# EAGLE design CBM Drive ID Switch Parallel Rev 1 (EAGLE 9.7.0)
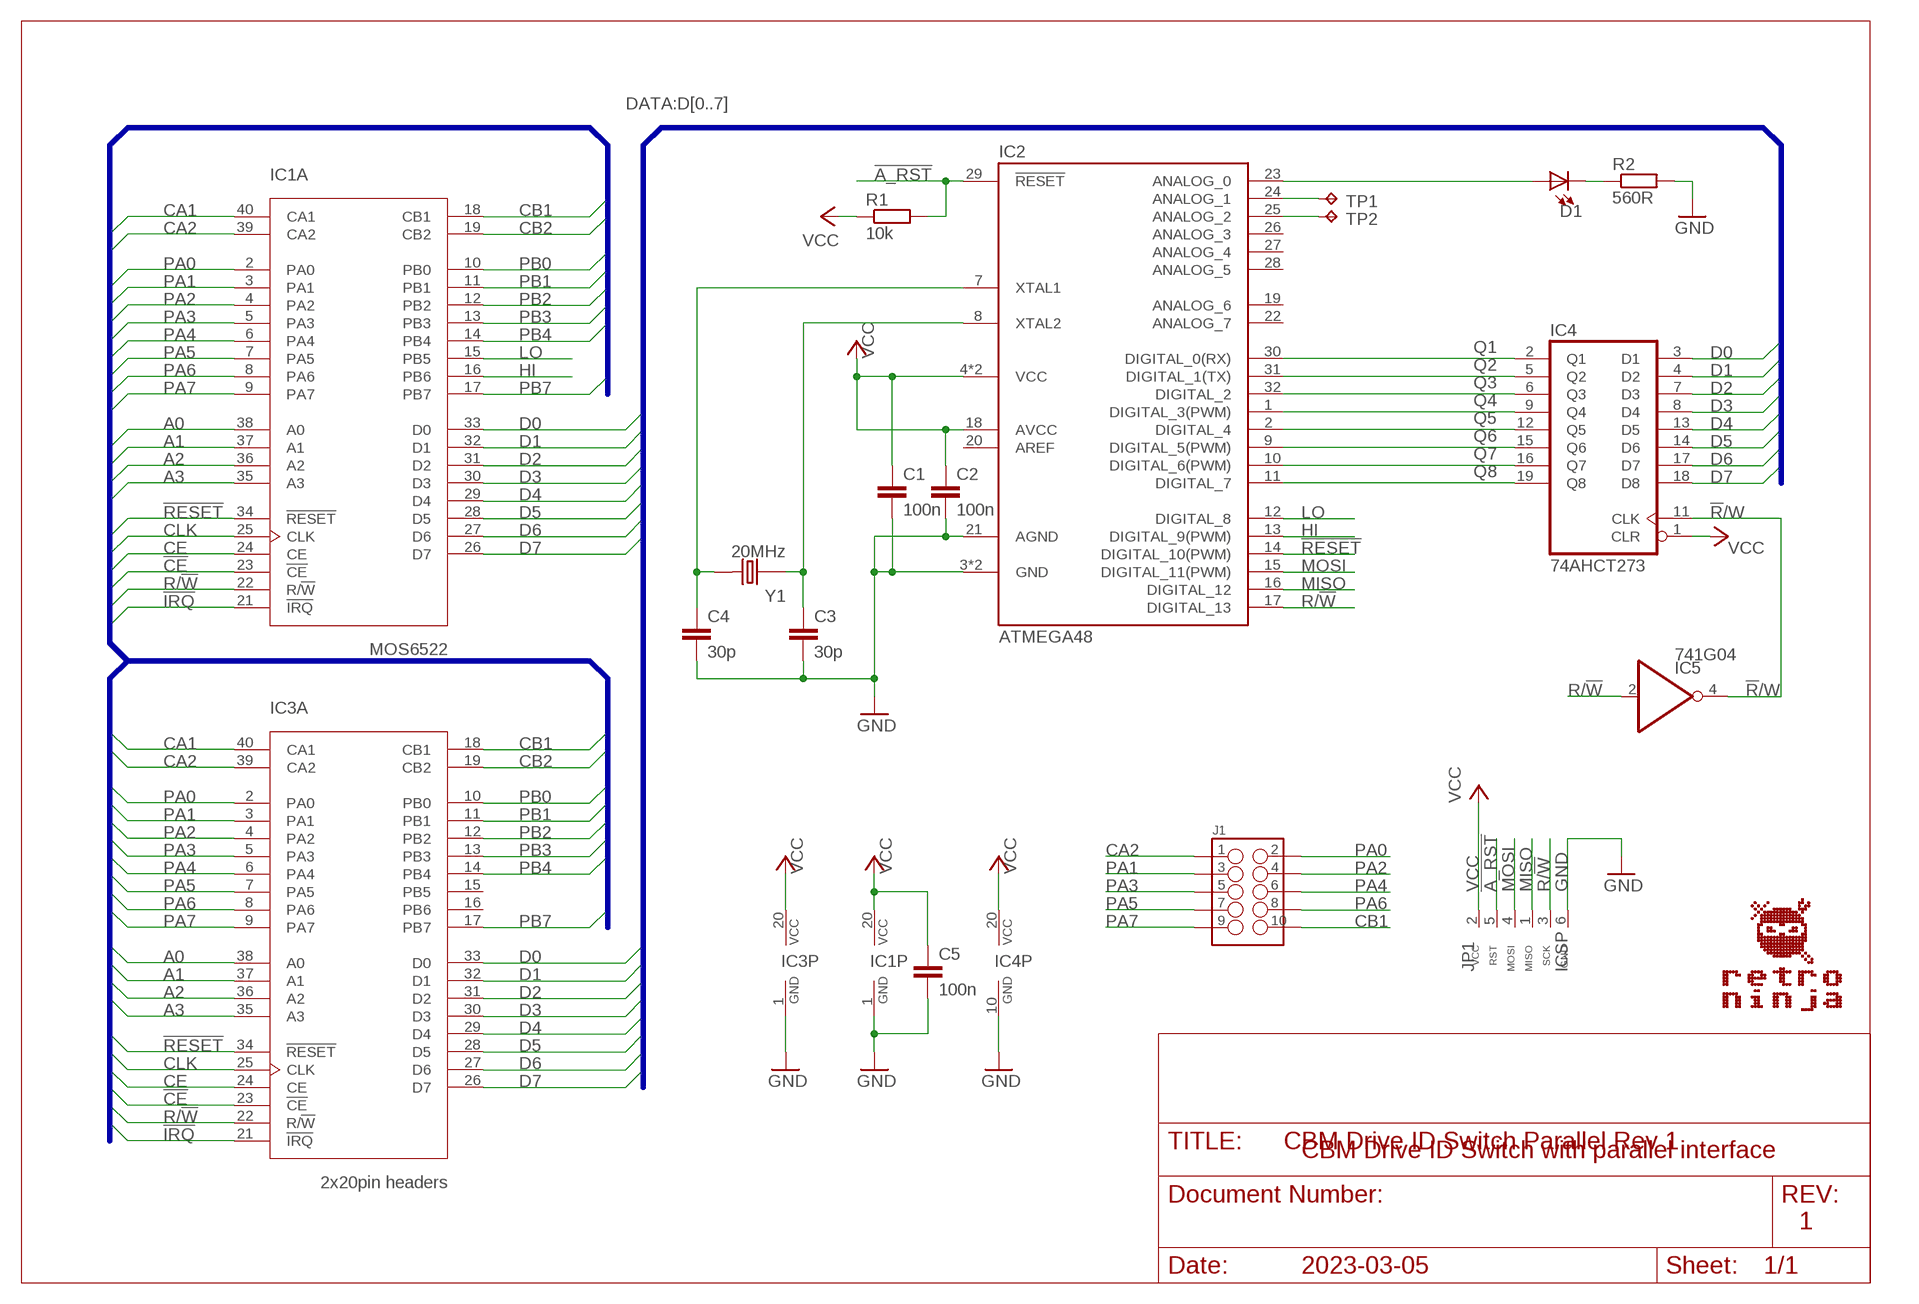
[diagram p0: schematic, sheet 1]

## Parts
C1  100n  C-EUC0805  [C0805]
C2  100n  C-EUC0805  [C0805]
C3  30p  C-EUC0805  [C0805]
C4  30p  C-EUC0805  [C0805]
C5  100n  C-EUC0805  [C0805]
D1  LED_0805  [LED0805]
IC1  MOS6522  MOS6522_HEADERS-F  [DIL40-6_HEADERS-F]
IC2  ATMEGA48  ARDUINO_168_328_TQFP  [TQFP-32]
IC3  2x20pin headers  MOS6522_ROUND_BOTTOMPINS  [DIL40-6_ROUND_BOTTOMPINS]
IC4  74AHCT273  74273N_NARROW  [SO20_NARROW]
IC5  741G04  741G04_SOT23  [SOT23-5]
J1  HEADER_2X5-WALLED-90  [HEADER_2X5_WALLED_RIGHT]
JP1  ICSP  ICSP_CONNECTOR_6_ALT  [HEADER_2X3_ALT]
R1  10k  R-EU_R0805  [R0805]
R2  560R  R-EU_R0805  [R0805]
TP1  TPTP20SQ  [TP20SQ]
TP2  TPTP20SQ  [TP20SQ]
Y1  20MHz  CRYSTAL  [CRYSTAL_SMD-2_7X4X2.3]

## Nets
!A_RST: IC2.29(!RESET) JP1.5(RST) R1.2
!CE: IC1.23(A:!CE) IC3.23(A:!CE)
!IRQ: IC1.21(A:!IRQ) IC3.21(A:!IRQ)
!R!/W: IC4.11(CLK) IC5.4(O)
!RESET: IC1.34(A:!RESET) IC2.14(DIGITAL_10(PWM)) IC3.34(A:!RESET)
A0: IC1.38(A:A0) IC3.38(A:A0)
A1: IC1.37(A:A1) IC3.37(A:A1)
A2: IC1.36(A:A2) IC3.36(A:A2)
A3: IC1.35(A:A3) IC3.35(A:A3)
CA1: IC1.40(A:CA1) IC3.40(A:CA1)
CA2: IC1.39(A:CA2) IC3.39(A:CA2) J1.1
CB1: IC1.18(A:CB1) IC3.18(A:CB1) J1.10
CB2: IC1.19(A:CB2) IC3.19(A:CB2)
CE: IC1.24(A:CE) IC3.24(A:CE)
CLK: IC1.25(A:CLK) IC3.25(A:CLK)
D0: IC1.33(A:D0) IC3.33(A:D0) IC4.3(D1)
D1: IC1.32(A:D1) IC3.32(A:D1) IC4.4(D2)
D2: IC1.31(A:D2) IC3.31(A:D2) IC4.7(D3)
D3: IC1.30(A:D3) IC3.30(A:D3) IC4.8(D4)
D4: IC1.29(A:D4) IC3.29(A:D4) IC4.13(D5)
D5: IC1.28(A:D5) IC3.28(A:D5) IC4.14(D6)
D6: IC1.27(A:D6) IC3.27(A:D6) IC4.17(D7)
D7: IC1.26(A:D7) IC3.26(A:D7) IC4.18(D8)
GND: C1.2 C2.2 C3.2 C4.2 C5.2 IC1.1(P:GND) IC2.3(GND) IC2.5(GND) IC2.21(AGND) IC3.1(P:GND) IC4.10(GND) JP1.6(GND) R2.2
HI: IC1.16(A:PB6) IC2.13(DIGITAL_9(PWM))
LO: IC1.15(A:PB5) IC2.12(DIGITAL_8)
MISO: IC2.16(DIGITAL_12) JP1.1(MISO)
MOSI: IC2.15(DIGITAL_11(PWM)) JP1.4(MOSI)
N$1: IC2.24(ANALOG_1) TP1.TP
N$2: IC2.25(ANALOG_2) TP2.TP
N$16: C3.1 IC2.8(XTAL2) Y1.1
N$17: C4.1 IC2.7(XTAL1) Y1.2
N$25: D1.A IC2.23(ANALOG_0)
N$26: D1.C R2.1
PA0: IC1.2(A:PA0) IC3.2(A:PA0) J1.2
PA1: IC1.3(A:PA1) IC3.3(A:PA1) J1.3
PA2: IC1.4(A:PA2) IC3.4(A:PA2) J1.4
PA3: IC1.5(A:PA3) IC3.5(A:PA3) J1.5
PA4: IC1.6(A:PA4) IC3.6(A:PA4) J1.6
PA5: IC1.7(A:PA5) IC3.7(A:PA5) J1.7
PA6: IC1.8(A:PA6) IC3.8(A:PA6) J1.8
PA7: IC1.9(A:PA7) IC3.9(A:PA7) J1.9
PB0: IC1.10(A:PB0) IC3.10(A:PB0)
PB1: IC1.11(A:PB1) IC3.11(A:PB1)
PB2: IC1.12(A:PB2) IC3.12(A:PB2)
PB3: IC1.13(A:PB3) IC3.13(A:PB3)
PB4: IC1.14(A:PB4) IC3.14(A:PB4)
PB7: IC1.17(A:PB7) IC3.17(A:PB7)
Q1: IC2.30(DIGITAL_0(RX)) IC4.2(Q1)
Q2: IC2.31(DIGITAL_1(TX)) IC4.5(Q2)
Q3: IC2.32(DIGITAL_2) IC4.6(Q3)
Q4: IC2.1(DIGITAL_3(PWM)) IC4.9(Q4)
Q5: IC2.2(DIGITAL_4) IC4.12(Q5)
Q6: IC2.9(DIGITAL_5(PWM)) IC4.15(Q6)
Q7: IC2.10(DIGITAL_6(PWM)) IC4.16(Q7)
Q8: IC2.11(DIGITAL_7) IC4.19(Q8)
R/!W: IC1.22(A:R/!W) IC2.17(DIGITAL_13) IC3.22(A:R/!W) IC5.2(I) JP1.3(SCK)
VCC: C1.1 C2.1 C5.1 IC1.20(P:VCC) IC2.4(VCC) IC2.6(VCC) IC2.18(AVCC) IC3.20(P:VCC) IC4.1(CLR) IC4.20(VCC) JP1.2(VCC) R1.1
Unconnected: IC2.19(ANALOG_6) IC2.20(AREF) IC2.22(ANALOG_7) IC2.26(ANALOG_3) IC2.27(ANALOG_4) IC2.28(ANALOG_5) IC3.15(A:PB5) IC3.16(A:PB6)

## Buses
DATA:D[0..7]
A[0..3],CA[0..1],CB[0..1],CE,!CE,CLK,!IRQ,PA[0..7],PB[0..7],!RESET,R/!W

## Notes on the sheet
- CBM Drive ID Switch with parallel interface
- 1
- 2023-03-05

## Power pins joined to a net without a drawn wire
GND: IC5.3(GND)
VCC: IC5.5(VCC)

## Library data of the parts
C1-C5 = rcl:C-EU: CAPACITOR, European symbol; SPICEPREFIX: C
D1 = Per (Fusion 360):LED
IC1 IC3 = Per (Fusion 360):MOS6522
IC2 = Per (Fusion 360):ARDUINO_168_328
IC4 = Per (Fusion 360):74*273
IC5 = Per (Fusion 360):74*1G04
J1 = Per (Fusion 360):HEADER_2X5
JP1 = Per (Fusion 360):ICSP_CONNECTOR: PIN HEADER
R1 R2 = rcl:R-EU_: RESISTOR, European symbol; SPICEPREFIX: R
TP1 TP2 = testpad:TP: Test pad
Y1 = Per (Fusion 360):CRYSTAL

## Board
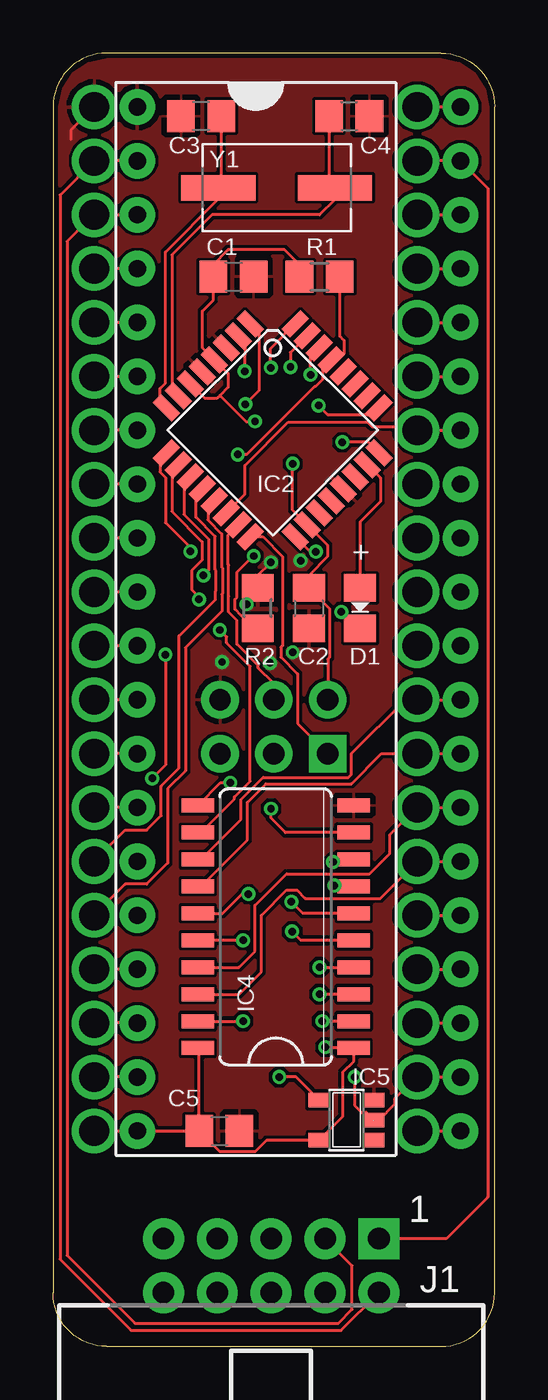
[diagram p1: board, top side]
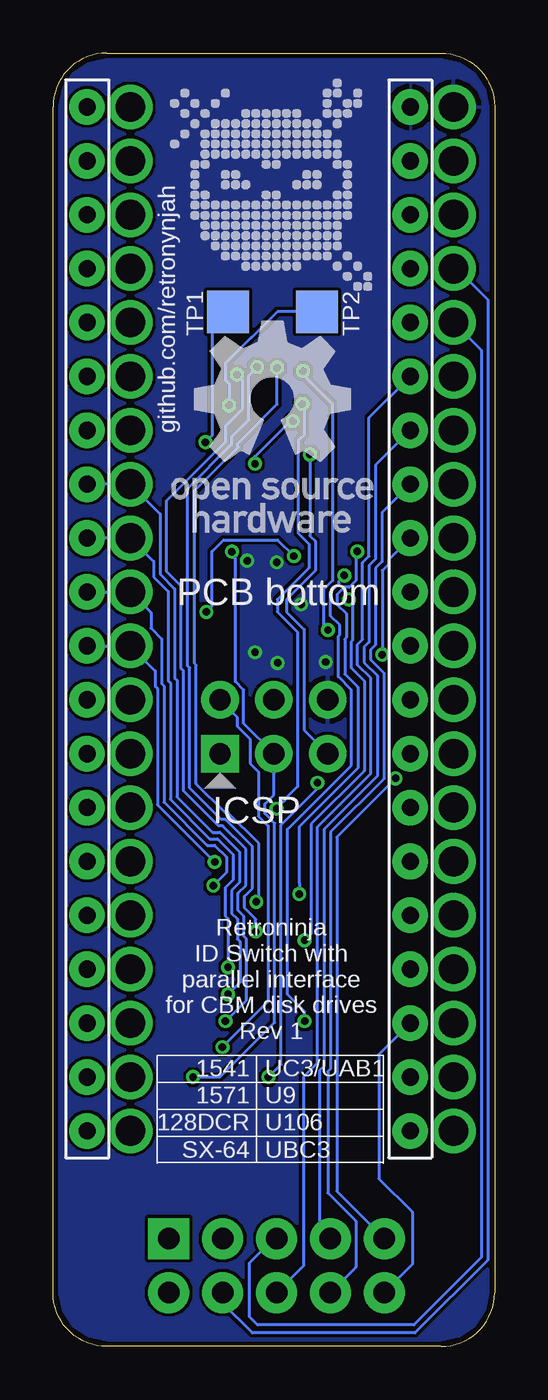
[diagram p2: board, bottom side, seen from below]

Size 20.83 x 60.96 mm. Coordinates in mm from the lower left corner, seen from the top.
Outline: 2.54,0 18.29,0 arc90 20.83,2.54 20.83,58.42 arc90 18.29,60.96 2.54,60.96 arc90 0,58.42 0,2.54 arc90 2.54,0
Copper layers (1*16): Top / Bottom
Stack-up Default Layer Stack: Top User Defined 0.035mm / Dielectric-1 User Defined 1.5mm / Bottom User Defined 0.035mm
Design rules "SeeedStudio_2layer_DRU_no_angle_20140221": minimum track width 6mil, minimum drill 12mil, track to track 6mil, track to pad 6mil, pad to pad 6mil, via to via 6mil, smd to smd 0mil, copper to edge 10mil, drill to drill 10mil, minimum pad ring 10mil, minimum via ring 6mil, stop-mask expansion 2mil, vias tented up to drill 100mil, thermal gap 10mil

### Footprints (pad centres in the part's own frame; a part is rotated, then mirrored left to right if it is on the bottom)
C0805 = smd 1.3 x 1.5: 1 -0.95,0; 2 0.95,0
LED0805 = smd 1.3 x 1.5: A -0.95,0; C 0.95,0
DIL40-6_HEADERS-F = drill 1.4: 1 -24.13,-7.62; 2 -21.59,-7.62; 3 -19.05,-7.62; 4 -16.51,-7.62; 5 -13.97,-7.62; 6 -11.43,-7.62; 7 -8.89,-7.62; 8 -6.35,-7.62; 9 -3.81,-7.62; 10 -1.27,-7.62; 11 1.27,-7.62; 12 3.81,-7.62; 13 6.35,-7.62; 14 8.89,-7.62; 15 11.43,-7.62; 16 13.97,-7.62; 17 16.51,-7.62; 18 19.05,-7.62; 19 21.59,-7.62; 20 24.13,-7.62; 21 24.13,7.62; 22 21.59,7.62; 23 19.05,7.62; 24 16.51,7.62; 25 13.97,7.62; 26 11.43,7.62; 27 8.89,7.62; 28 6.35,7.62; 29 3.81,7.62; 30 1.27,7.62; 31 -1.27,7.62; 32 -3.81,7.62; 33 -6.35,7.62; 34 -8.89,7.62; 35 -11.43,7.62; 36 -13.97,7.62; 37 -16.51,7.62; 38 -19.05,7.62; 39 -21.59,7.62; 40 -24.13,7.62
TQFP-32 = smd 1.27 x 0.559: 1 -4.293,2.8; 2 -4.293,2; 3 -4.293,1.2; 4 -4.293,0.4; 5 -4.293,-0.4; 6 -4.293,-1.2; 7 -4.293,-2; 8 -4.293,-2.8; 17 4.293,-2.8; 18 4.293,-2; 19 4.293,-1.2; 20 4.293,-0.4; 21 4.293,0.4; 22 4.293,1.2; 23 4.293,2; 24 4.293,2.8 | smd 0.559 x 1.27: 9 -2.8,-4.293; 10 -2,-4.293; 11 -1.2,-4.293; 12 -0.4,-4.293; 13 0.4,-4.293; 14 1.2,-4.293; 15 2,-4.293; 16 2.8,-4.293; 25 2.8,4.293; 26 2,4.293; 27 1.2,4.293; 28 0.4,4.293; 29 -0.4,4.293; 30 -1.2,4.293; 31 -2,4.293; 32 -2.8,4.293
DIL40-6_ROUND_BOTTOMPINS = drill 0.813 pad 1.676: 1 -24.13,-7.62; 2 -21.59,-7.62; 3 -19.05,-7.62; 4 -16.51,-7.62; 5 -13.97,-7.62; 6 -11.43,-7.62; 7 -8.89,-7.62; 8 -6.35,-7.62; 9 -3.81,-7.62; 10 -1.27,-7.62; 11 1.27,-7.62; 12 3.81,-7.62; 13 6.35,-7.62; 14 8.89,-7.62; 15 11.43,-7.62; 16 13.97,-7.62; 17 16.51,-7.62; 18 19.05,-7.62; 19 21.59,-7.62; 20 24.13,-7.62; 21 24.13,7.62; 22 21.59,7.62; 23 19.05,7.62; 24 16.51,7.62; 25 13.97,7.62; 26 11.43,7.62; 27 8.89,7.62; 28 6.35,7.62; 29 3.81,7.62; 30 1.27,7.62; 31 -1.27,7.62; 32 -3.81,7.62; 33 -6.35,7.62; 34 -8.89,7.62; 35 -11.43,7.62; 36 -13.97,7.62; 37 -16.51,7.62; 38 -19.05,7.62; 39 -21.59,7.62; 40 -24.13,7.62
SO20_NARROW = smd 0.66 x 1.524: 1 -5.369,-3.765; 2 -4.099,-3.765; 3 -2.829,-3.765; 4 -1.559,-3.765; 5 -0.289,-3.765; 6 0.981,-3.765; 7 2.251,-3.765; 8 3.521,-3.765; 9 4.791,-3.765; 10 6.061,-3.765; 11 6.061,3.585; 12 4.791,3.585; 13 3.521,3.585; 14 2.251,3.585; 15 0.981,3.585; 16 -0.289,3.585; 17 -1.559,3.585; 18 -2.829,3.585; 19 -4.099,3.585; 20 -5.369,3.585
SOT23-5 = smd 0.69 x 0.99: 1 -0.95,-1.29; 2 0,-1.29; 3 0.95,-1.29; 4 0.95,1.3; 5 -0.95,1.3
HEADER_2X5_WALLED_RIGHT = drill 1.016 pad 1.93 square: 1 -5.08,-6.35 | drill 1.016 pad 1.93: 2 -5.08,-3.81; 3 -2.54,-6.35; 4 -2.54,-3.81; 5 0,-6.35; 6 0,-3.81; 7 2.54,-6.35; 8 2.54,-3.81; 9 5.08,-6.35; 10 5.08,-3.81
HEADER_2X3_ALT = drill 1 pad 1.778 square: 1 -2.54,-1.27 | drill 1 pad 1.778: 2 -2.54,1.27; 3 0,-1.27; 4 0,1.27; 5 2.54,-1.27; 6 2.54,1.27
R0805 = smd 1.3 x 1.5: 1 -0.95,0; 2 0.95,0
TP20SQ = smd 2 x 2: TP 0,0
CRYSTAL_SMD-2_7X4X2.3 = smd 3.5 x 1.2: 1 -2.75,0; 2 2.75,0

### Placement (x,y rotation side)
C1  8.51,50.42 0 top
C2  12.06,34.8 270 top
C3  6.99,57.99 180 top
C4  13.97,57.99 0 top
C5  7.84,10.16 0 top
D1  14.48,34.8 270 top
IC1  9.56,34.29 270 top
IC2  10.36,43.18 315 top
IC3  11.6,34.29 270 top
IC4  10.41,19.43 90 top
IC5  13.84,10.67 90 top
J1  10.29,-1.27 180 top
JP1  10.41,29.21 0 bottom
R1  12.57,50.42 0 top
R2  9.65,34.8 90 top
TP1  12.57,48.77 0 bottom
TP2  8.38,48.77 0 bottom
U$1  [RETRONINJA_NOTEXT_10MM]  10.54,54.99 0 bottom
U$2  [OSHW_10MM]  15.24,38.35 0 bottom
Y1  10.54,54.61 0 top

### Tracks (layer width: path | path; a pad name or v marks a point on that pad's centre or on a via)
!A_RST  (via drill 0.35)
  Top 0.152: R1.2 13.52,47.62 13.73,47.41 13.73,46.81 IC2.29 12.71,46.09 12.71,45.57 12.38,45.24 12.33,45.24 9.13,42.04 v8.71,42.04
  Bottom 0.152: JP1.5 8.99,29.06 8.99,33.8 9.81,34.62 9.81,35.21 8.46,36.56 8.46,37.95 8.71,38.2 v8.71,42.04
!CE
  Top 0.152: IC1.23 IC3.23
!IRQ
  Top 0.152: IC1.21 IC3.21
!R!/W  (via drill 0.35)
  Top 0.152: IC5.4 11.46,12.7 v10.67,12.7 | IC4.11 7.9,26.57 v8.36,26.57
  Bottom 0.152: v10.67,12.7 10.08,13.29 10.08,24.59 8.36,26.31 v8.36,26.57
!RESET
  Top 0.152: IC3.34 IC1.34 17,43.36 15.03,43.36 14.83,43.56 11.08,43.56 9.04,41.52 9.04,40.16 IC2.14
A0
  Top 0.152: IC1.38 IC3.38
A1
  Top 0.152: IC1.37 IC3.37
A2
  Top 0.152: IC1.36 IC3.36
A3
  Top 0.152: IC1.35 IC3.35
CA1
  Top 0.152: IC1.40 IC3.40
CA2
  Top 0.152: IC1.39 IC3.39 20.5,54.6 20.5,7.04 18.54,5.08 J1.1
CB1
  Top 0.152: IC3.18 IC1.18
  Bottom 0.152: IC3.18 5.46,13.76 5.46,7.91 3.89,6.34 3.89,3.86 J1.10
CB2
  Top 0.152: IC3.19 IC1.19
CE
  Top 0.152: IC1.24 IC3.24
CLK
  Top 0.152: IC1.25 IC3.25
D0  (via drill 0.35)
  Top 0.152: IC4.3 v12.57,16.6
  Bottom 0.152: IC3.33 IC1.33 15.77,39.23 15.77,36.39 15.09,35.71 15.09,31.49 14.99,31.39 14.99,25.91 13.31,24.23 12.95,24.23 12.04,23.32 12.04,21.86 12.41,21.49 12.41,20.42 12.14,20.15 12.14,19.2 12.02,19.08 12.02,17.16 v12.57,16.6
D1  (via drill 0.35)
  Top 0.152: v12.57,17.87 IC4.4
  Bottom 0.152: IC3.32 IC1.32 16.08,37 16.08,36.27 15.39,35.58 15.39,31.36 15.29,31.26 15.29,25.78 13.44,23.93 13.08,23.93 12.34,23.19 12.34,21.99 12.71,21.62 12.71,20.29 12.57,20.15 v12.57,17.87
D2  (via drill 0.35)
  Top 0.152: v13.27,21.72 13.31,21.68 IC4.7
  Bottom 0.152: IC3.31 IC1.31 16.2,34.59 16.2,33.85 15.7,33.35 15.7,31.24 15.6,31.14 15.6,25.66 13.56,23.62 13.2,23.62 12.65,23.07 12.65,22.34 v13.27,21.72
D3  (via drill 0.35)
  Top 0.152: IC4.8 13.32,22.95 v13.2,22.84
  Bottom 0.152: IC3.30 IC1.30 16,31.84 16,31.11 15.9,31.01 15.9,25.53 13.69,23.32 v13.2,22.84
D4
  Top 0.152: IC3.29 IC1.29 16.61,30.48 14.07,27.94 14.07,26.96 13.94,26.82 9.91,26.82 8.86,25.77 8.86,24.84 6.97,22.95 IC4.13
D5
  Top 0.152: IC3.28 IC1.28 15.49,27.94 14.06,26.52 10.04,26.52 9.17,25.65 9.17,23.87 6.97,21.68 IC4.14
D6
  Top 0.152: IC4.17 8.76,17.87 9.52,18.63 9.52,20.79 11.01,22.28 14.92,22.28 15.88,23.23 15.88,24.13 17.14,25.4 IC1.27 IC3.27
D7
  Top 0.152: IC4.18 8.76,16.6 9.82,17.66 9.82,20.32 11.01,21.51 11.51,21.51 11.89,21.12 15.44,21.12 IC1.26 IC3.26
GND  (via drill 0.35)
  Top 0.152: IC1.1 0.84,57.32 0.84,56.9 | v10.28,36.96 9.65,36.33 R2.2 9.13,35.23 v9.13,34.98
  other vias: 7.97,32.26 11.67,37.04 10.23,32.22 11.3,32.72
  pour Bottom: 20.83,0 0,0 0,60.96 20.83,60.96
  pour Top: 20.83,0 0,0 0,60.96 20.83,60.96
HI
  Top 0.152: IC1.16 3.41,21.79 4.42,21.79 5.41,22.78 5.41,26.29 6.25,27.13 6.25,32.94 7.97,34.65 7.97,35.46 7.98,35.48 7.98,36.69 7.95,36.73 7.95,38.3 7.3,38.95 7.3,39.55 IC2.13
LO
  Top 0.152: IC2.12 6.74,40.12 6.74,39.09 7.65,38.17 7.65,36.6 7.68,36.57 7.68,35.6 7.66,35.59 7.66,35.2 5.94,33.48 5.94,27.25 5.11,26.42 5.11,25.02 4.42,24.33 3.41,24.33 IC1.15
MISO
  Top 0.152: IC2.16 9.9,38.16 10.83,37.23 10.83,33.03 10.75,32.95 10.75,32.49 11.53,31.7 11.53,29.36 JP1.1
MOSI
  Top 0.152: IC2.15 8.26,38.24 8.26,36.85 8.29,36.82 8.29,35.35 8.27,35.33 8.27,34.62 8.67,34.22 8.67,33.1 9.68,32.1 9.68,31.98 10.41,31.25 JP1.4
N$1  (via drill 0.35)
  Top 0.152: IC2.24 14.88,42.62 v13.64,42.62
  Bottom 0.152: v13.64,42.62 13.34,42.93 13.34,48.01 TP1.TP
N$2  (via drill 0.35)
  Top 0.152: IC2.25 15.07,43.93 12.95,43.93 v12.53,44.35
  Bottom 0.152: TP2.TP 10.25,48.77 11.48,47.54 11.49,47.54 12.71,46.33 12.71,45.57 12.53,45.39 v12.53,44.35
N$16
  Top 0.152: C3.1 7.93,55.01 Y1.1 7.79,54.07 5.3,51.58 5.3,45.41 5.04,45.15 5.04,44.55 IC2.8
N$17
  Top 0.152: C4.1 13.02,54.88 Y1.2 13.29,54.06 12.57,53.34 7.49,53.34 5.6,51.45 5.6,45.11 IC2.7
N$25
  Top 0.152: D1.A 14.48,38.86 15.43,39.81 15.43,40.95 IC2.23
N$26  (via drill 0.35)
  Top 0.152: v13.6,34.62 14.37,33.85 D1.C | R2.1 9.08,34.42 8.9,34.42 8.58,34.75 8.58,35.21 8.67,35.31 8.67,36.49 9.43,37.25 v9.47,37.25
  Bottom 0.152: v13.6,34.62 13.34,34.88 13.34,37.47 12.78,38.02 10.23,38.02 v9.47,37.25
PA0
  Top 0.152: IC3.2 IC1.2 0.33,54.27 0.33,4.12 3.68,0.76 13.59,0.76 J1.2
PA1
  Top 0.152: IC3.3 IC1.3 1.91,53.34 0.66,52.09 0.66,4.29 3.86,1.09 13.45,1.09 14.1,1.74 14.1,3.81 J1.3
PA2
  Top 0.152: IC3.4 IC1.4
  Bottom 0.152: IC1.4 1.78,50.8 0.33,49.35 0.33,4.07 3.76,0.64 11.43,0.64 12.83,2.03 J1.4
PA3
  Top 0.152: IC3.5 IC1.5
  Bottom 0.152: IC1.5 0.64,46.96 0.64,4.19 3.81,1.02 11.18,1.02 11.56,1.4 11.56,3.94 10.41,5.08 J1.5
PA4
  Top 0.152: IC3.6 IC1.6
  Bottom 0.152: J1.6 9.02,3.81 9.02,12.7 8.35,13.36 8.35,24.5 5.84,27.01 5.84,31.5 6.46,32.12 6.46,33.09 6.23,33.32 6.23,36.94 5.92,37.24 5.92,43.77 IC3.6
PA5
  Top 0.152: IC3.7 IC1.7
  Bottom 0.152: J1.7 8.26,5.59 8.26,13 8.05,13.21 8.05,24.37 5.54,26.88 5.54,31.62 6.16,32.25 6.16,32.96 5.92,33.19 5.92,36.81 5.62,37.12 5.62,41.54 IC3.7
PA6
  Top 0.152: IC3.8 IC1.8
  Bottom 0.152: J1.8 6.55,3.73 6.55,5.92 7.87,7.24 7.87,12.95 7.75,13.08 7.75,24.24 5.23,26.75 5.23,31.75 5.85,32.37 5.85,32.83 5.62,33.07 5.62,36.69 5.32,36.99 5.32,39.3 IC3.8
PA7  (via drill 0.35)
  Top 0.152: IC3.9 IC1.9 | v5.3,32.6 5.3,27.39 v4.68,26.77
  Bottom 0.152: J1.9 7.44,7.31 7.44,24.01 v4.68,26.77 | IC3.9 5.01,37.07 5.01,36.86 5.3,36.58 v5.3,32.6
PB0
  Top 0.152: IC3.10 IC1.10
PB1
  Top 0.152: IC3.11 IC1.11
PB2
  Top 0.152: IC3.12 IC1.12
PB3
  Top 0.152: IC3.13 IC1.13
PB4
  Top 0.152: IC3.14 IC1.14
PB7
  Top 0.152: IC3.17 IC1.17
Q1  (via drill 0.35)
  Top 0.152: IC4.2 v12.7,15.33 | v12.15,45.8 12.15,46.66 IC2.30
  Bottom 0.152: v12.15,45.8 11.9,45.55 11.9,44.19 12.7,43.38 12.7,42.64 15.47,39.88 15.47,36.52 14.78,35.83 14.78,31.95 14.68,31.85 14.68,26.19 13.03,24.54 12.83,24.54 11.73,23.44 11.73,21.73 12.1,21.36 12.1,20.55 11.83,20.27 11.83,19.33 11.71,19.21 11.71,16.32 v12.7,15.33
Q2  (via drill 0.35)
  Top 0.152: v11.2,46.17 11.2,46.84 IC2.31 | IC4.5 11.69,19.14 v11.28,19.56
  Bottom 0.152: v11.2,46.17 11.59,45.77 11.59,43.68 12.4,42.88 12.4,42.52 14.48,40.44 14.48,32.08 14.38,31.98 14.38,26.31 12.9,24.84 12.7,24.84 11.43,23.57 11.43,21.59 11.8,21.22 11.8,20.67 11.28,20.15 v11.28,19.56
Q3  (via drill 0.35)
  Top 0.152: v10.28,46.13 v10.26,46.14 10.26,47.04 IC2.32 | IC4.6 11.78,20.41 v11.24,20.95
  Bottom 0.152: v10.28,46.13 10.26,46.11 10.26,44.41 12.09,42.58 12.09,42.39 14.16,40.33 14.16,32.19 14.07,32.11 14.07,26.52 12.7,25.15 12.57,25.15 11.12,23.7 11.12,21.07 v11.24,20.95
Q4  (via drill 0.35)
  Top 0.152: IC4.9 10.96,24.22 10.28,24.9 v10.28,25.35 | IC2.1 9.72,47.78 9.72,45.06 v9.07,44.41
  Bottom 0.152: v10.28,25.35 9.9,25.72 9.9,25.78 9.3,26.39 9.3,33.67 10.25,34.62 10.25,35.21 8.76,36.69 8.76,37.82 9.27,38.33 9.27,42.69 8.97,42.99 8.97,44.31 v9.07,44.41
Q5  (via drill 0.35)
  Top 0.152: IC4.12 6.97,24.22 8.56,25.8 8.56,25.9 9.29,26.64 9.29,32.05 8.18,33.16 8.18,33.44 v7.86,33.77 | v9.04,45.97 9.04,46.7 9.05,46.72 9.05,47.32 IC2.2
  Bottom 0.152: v9.04,45.97 9.04,45.8 7.65,44.41 7.65,36.09 8.06,35.68 8.06,33.97 v7.86,33.77
Q6  (via drill 0.35)
  Top 0.152: IC4.15 8,20.41 8.91,21.32 v9.21,21.32 | IC2.9 5.04,41.81 5.04,41.21 5.3,40.95 5.3,38.83 6.48,37.65 v6.48,37.47
  Bottom 0.152: v9.21,21.32 9.21,21.84 9.22,21.85 9.22,24.49 6.45,27.26 6.45,31.07 7.07,31.69 7.07,33.34 7,33.41 7,34.54 7.44,34.98 7.44,35.44 7.1,35.78 6.86,35.78 6.53,36.11 6.53,37.42 v6.48,37.47
Q7  (via drill 0.35)
  Top 0.152: IC2.10 5.6,41.25 5.6,39.35 7.04,37.92 7.04,37.07 6.53,36.57 6.53,35.67 6.88,35.32 v6.88,35.21 | v8.96,19.14 IC4.16
  Bottom 0.152: v8.96,19.14 8.66,19.45 8.66,24.62 6.15,27.13 6.15,31.37 6.77,31.99 6.77,33.21 6.7,33.28 6.7,35.02 v6.88,35.21
Q8  (via drill 0.35)
  Top 0.152: IC2.11 6.17,40.68 6.17,39.22 7.34,38.05 7.34,36.59 v7.09,36.34 | IC4.19 v8.96,15.33
  Bottom 0.152: v8.96,15.33 8.96,15.79 9.77,16.59 9.77,24.37 6.76,27.39 6.76,30.94 7.38,31.56 7.38,33.46 7.31,33.53 7.31,33.99 7.74,34.43 7.74,35.57 7.34,35.97 7.34,36.09 v7.09,36.34
R/!W  (via drill 0.35)
  Top 0.152: IC3.22 IC1.22 17.14,12.7 16.13,11.68 16.13,11.43 15.37,10.67 IC5.2 14.76,11.04 14.54,11.04 14.22,11.36 v14.22,12.7 | v12.39,37.46 12.12,37.46 IC2.17
  Bottom 0.152: v14.22,12.7 12.95,12.7 10.38,15.27 10.38,24.66 10.84,25.11 10.84,25.58 10.41,26 JP1.3 11.84,29.36 11.84,30.94 12.23,31.34 12.23,37.3 v12.39,37.46
VCC  (via drill 0.35)
  Top 0.152: R1.1 11.62,50.99 10.92,51.69 8.26,51.69 7.49,50.93 7.49,50.48 C1.1 7.56,49.32 7.05,48.81 7.05,47.06 IC2.4 8.26,45.85 8.26,45.21 7.87,44.82 | IC1.20 IC3.20 C5.1 | C5.1 6.89,14 IC4.20 | C5.1 7.87,9.18 9.54,9.18 10.07,9.72 IC5.5 13.67,10.84 13.67,12.93 14.18,13.44 IC4.1 14.14,14.1 12.85,14.1 v12.84,14.11 | JP1.2 12.95,32.38 13.04,32.48 13.04,34.77 C2.1 12.06,36.35 12.95,37.23 12.95,37.77 IC2.18 11.3,39.41 v11.3,41.61 | IC2.6 7.14,44.7 7.75,44.7 7.87,44.82 | 7.87,44.82 9.09,43.6 v9.53,43.6
  Bottom 0.152: JP1.2 12.14,29.67 12.14,29.24 11.53,28.63 11.53,27.48 11.14,27.09 11.14,24.99 10.69,24.53 10.69,16.26 v12.84,14.11 | v11.3,41.61 11.3,41.95 9.65,43.6 v9.53,43.6

### Text on the board
tPlace: + | 1
bPlace: github.com/retronynjah | PCB bottom | Retroninja / ID Switch with / parallel interface / for CBM disk drives / Rev 1 | UC3/UAB1 / U9 / U106 / UBC3 | 1541 / 1571 / 128DCR / SX-64